# Altium schematic sheet [8]-GSM_MODEM_CONNECTORS.SchDoc
size A4
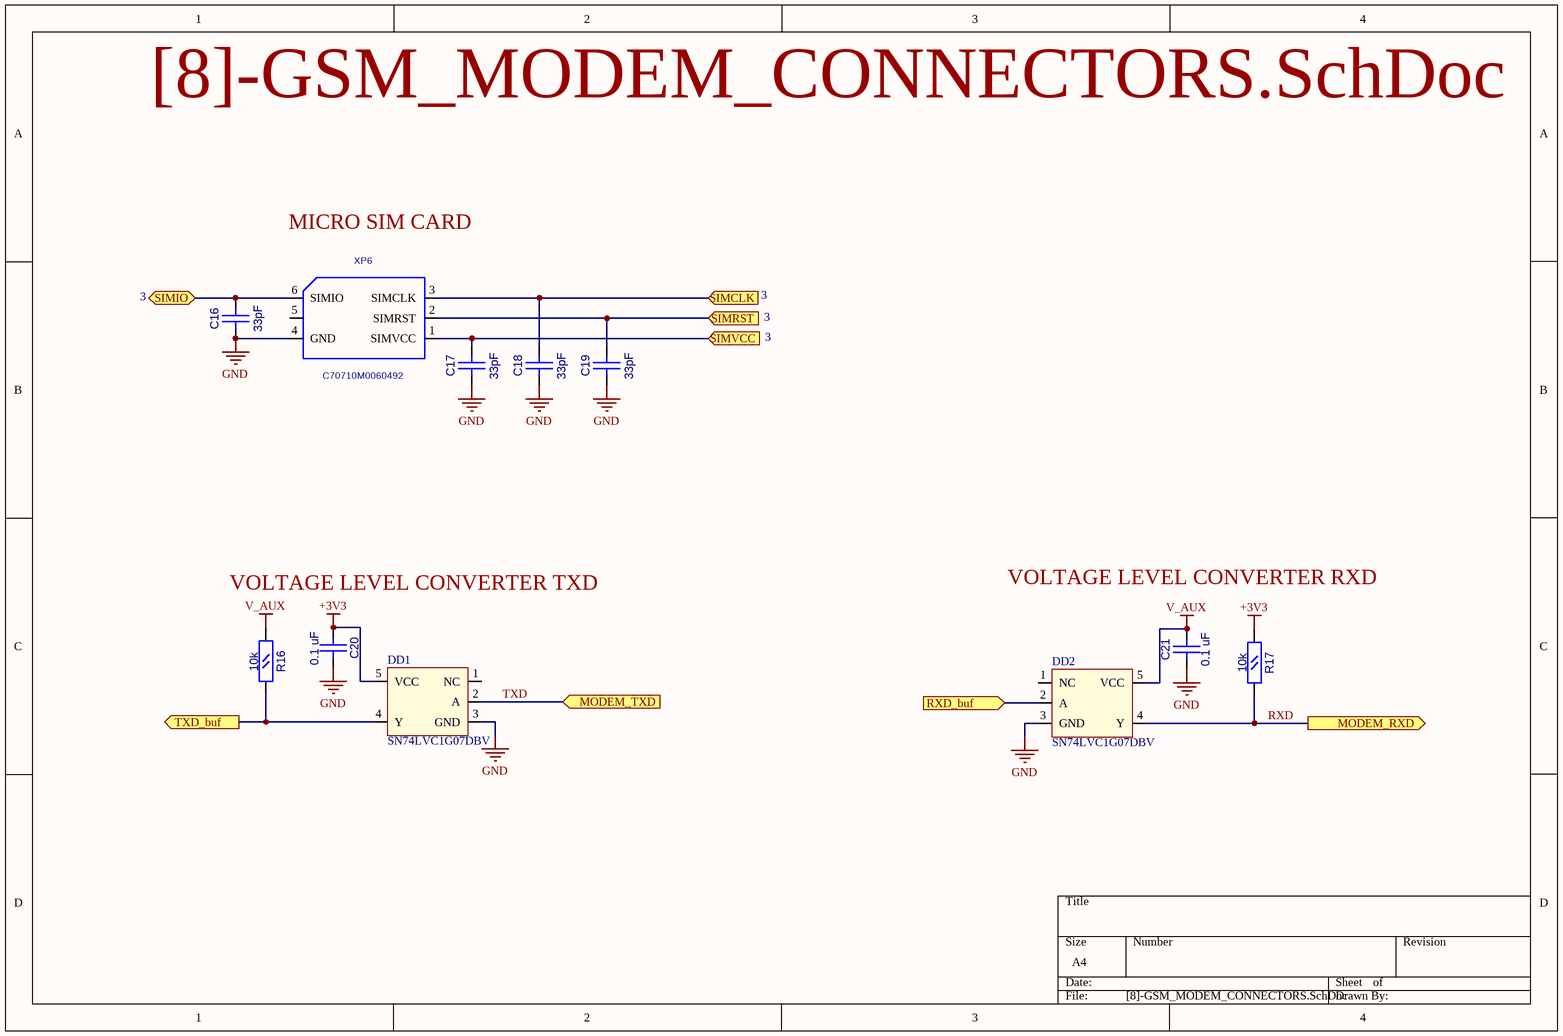
[diagram p0: [8]-GSM_MODEM_CONNECTORS.SchDoc]

## Parts
C16  33pF  [CC0603]
C17  33pF  [CC0603]
C18  33pF  [CC0603]
C19  33pF  [CC0603]
C20  0.1 uF  [CC0603]
C21  0.1 uF  [CC0603]
DD1  SN74LVC1G07DBV  [SOT23-5]
DD2  SN74LVC1G07DBV  [SOT23-5]
R16  10k  [RC0603]
R17  10k  [RC0603]
XP6  C70710M0060492  [SCVW06A25020]

## Ports
MODEM_RXD (out), MODEM_TXD (in), RXD_buf (in), SIMCLK (in), SIMIO (bidir), SIMRST (in), SIMVCC (in), TXD_buf (out)

## Nets
+3V3: C20.2(B) DD1.5(VCC) R17.1(A)
GND: C16.1(A) C17.1(A) C18.1(A) C19.1(A) C20.1(A) C21.1(A) DD1.3(GND) DD2.3(GND) XP6.4(GND)
V_AUX: C21.2(B) DD2.5(VCC) R16.1(A)
RXD: DD2.4(Y) R17.2(B) ; port MODEM_RXD
RXD_buf: DD2.2(A) ; port RXD_buf
SIMCLK: C18.2(B) XP6.3(SIMCLK) ; port SIMCLK
SIMIO: C16.2(B) XP6.6(SIMIO) ; port SIMIO
SIMRST: C19.2(B) XP6.2(SIMRST) ; port SIMRST
SIMVCC: C17.2(B) XP6.1(SIMVCC) ; port SIMVCC
TXD: DD1.2(A) ; port MODEM_TXD
TXD_buf: DD1.4(Y) R16.2(B) ; port TXD_buf

Not connected (* = marked no-connect by the designer): DD1 1(NC); DD2 1(NC); XP6 5

## Notes on the sheet
- MICRO SIM CARD
- 3
- VOLTAGE LEVEL CONVERTER RXD
- VOLTAGE LEVEL CONVERTER TXD

## Library data of the parts
C16-C21 = CC0603
  C16-C19: Value: 33pF
  C20 C21: Value: 0.1 uF
DD1 DD2 = SN74LVC1G07DBV: Open Drain Single Bus Bufer
R16 R17 = RC0603: Value: 10k
XP6 = SCV-W06A25-020: Value: *